# EAGLE schematic my board2 (EAGLE 6.2)
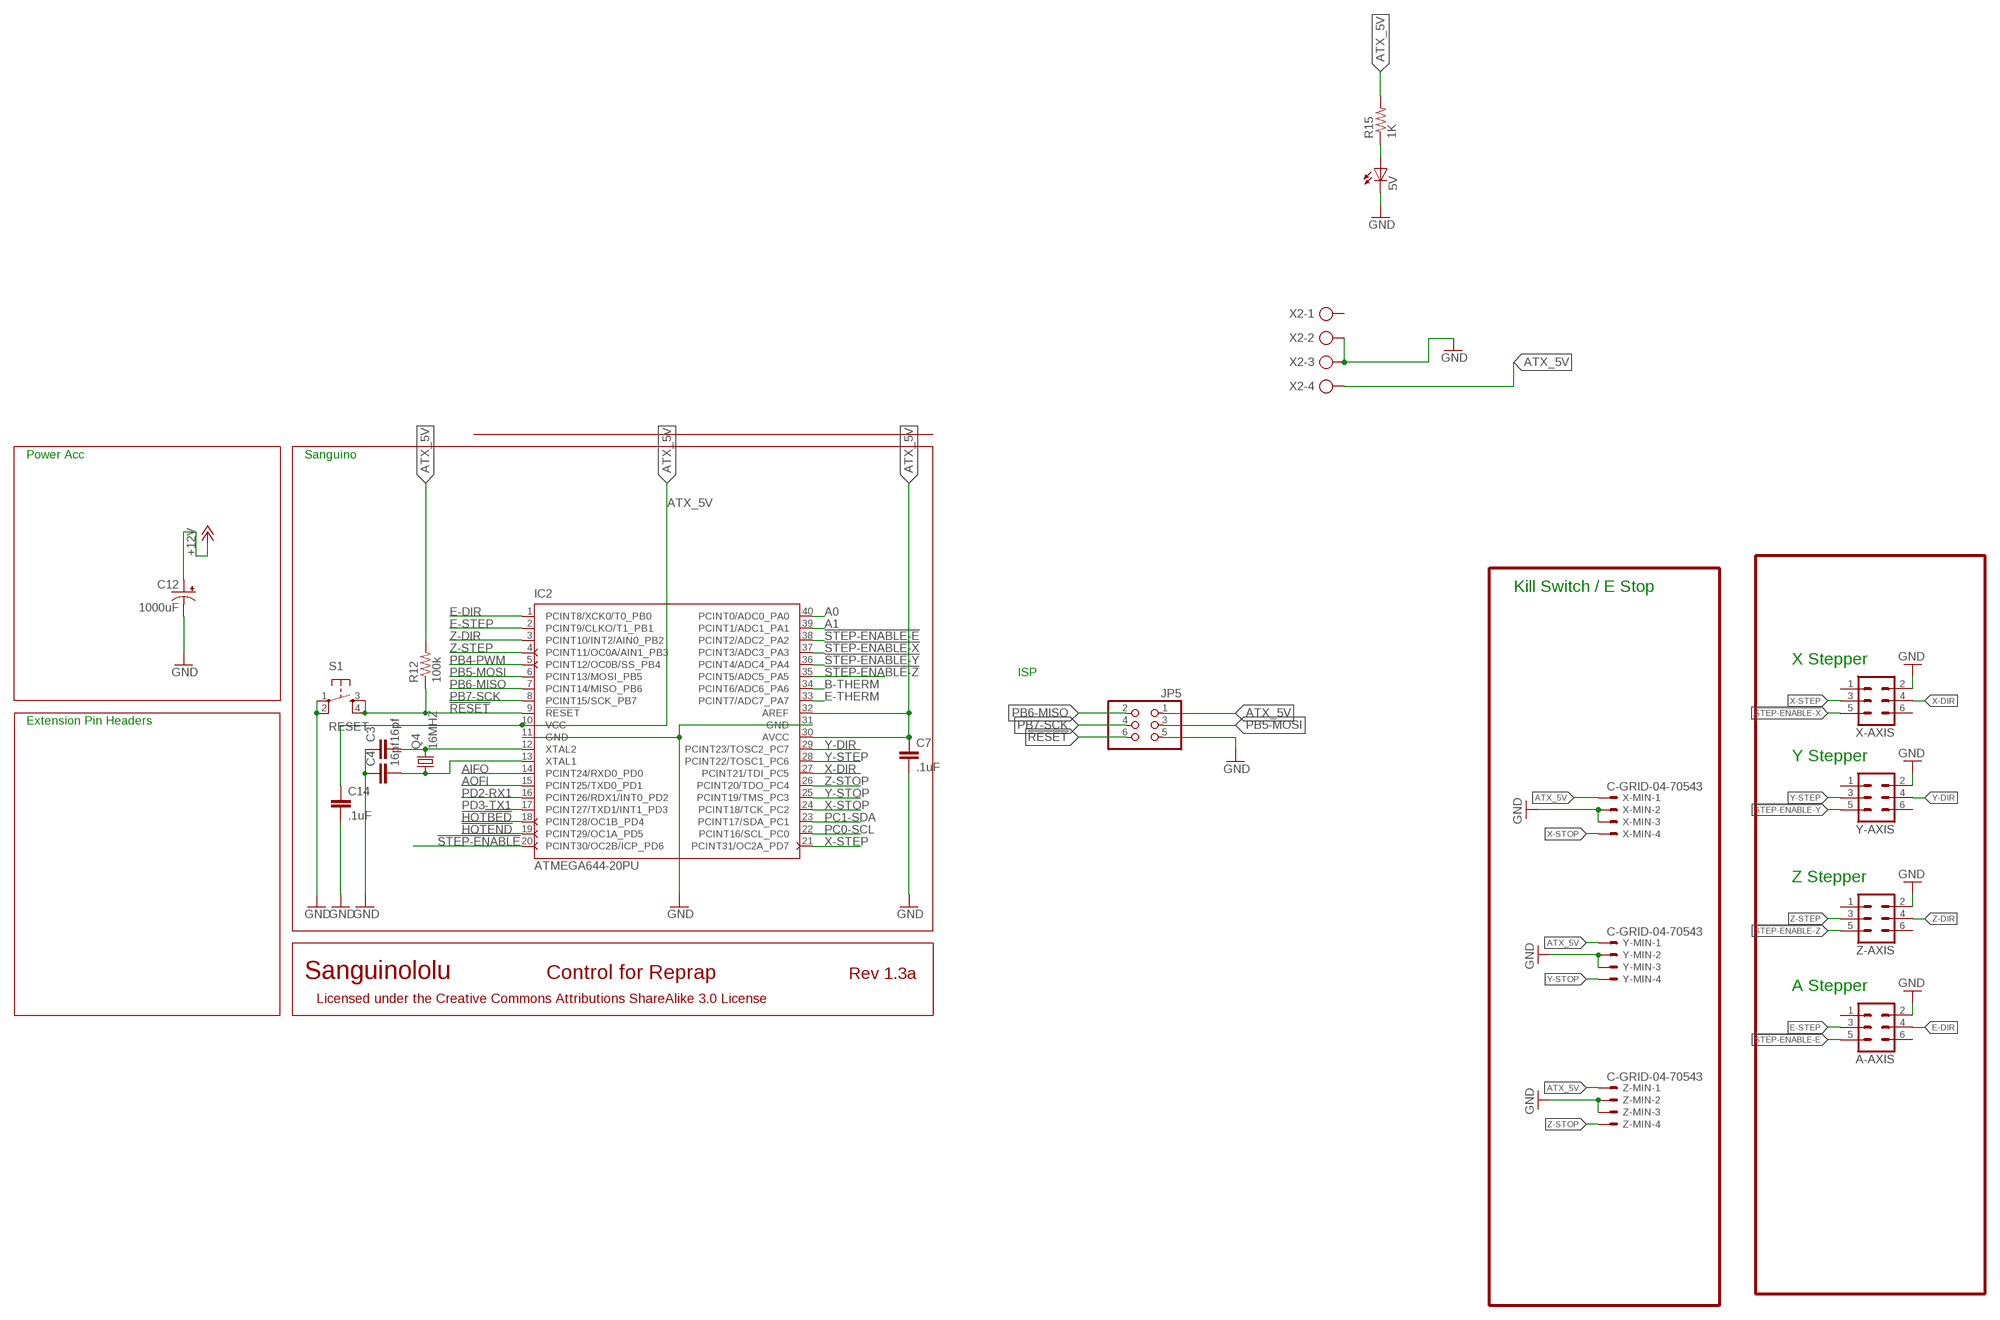
[diagram p0: schematic, sheet 1]

## Parts
5V  LED0805  [LED-0805]
A-AXIS  ML6  [ML6]
C3  16pf  CAP0805  [0805]
C4  16pf  CAP0805  [0805]
C7  .1uF  CAP0805  [0805]
C12  1000uF  CAP_POLPTH4  [CPOL-RADIAL-1000UF-25V]
C14  .1uF  CAP0805  [0805]
IC2  ATMEGA644-20PU  [DIL40]
JP5  PINHD-2X3  [2X03]
Q4  16MHZ  CRYSTALHC49S  [HC49/S]
R12  100k  RESISTORPTH1  [AXIAL-0.3]
R15  1K  RESISTOR  [0805]
S1  RESET  TAC_SWITCHPTH  [TACTILE-PTH]
X2  AK300/4  [AK300/4]
X-AXIS  ML6  [ML6]
X-MIN  C-GRID-04-70543  [70543-04]
Y-AXIS  ML6  [ML6]
Y-MIN  C-GRID-04-70543  [70543-04]
Z-AXIS  ML6  [ML6]
Z-MIN  C-GRID-04-70543  [70543-04]

## Nets
!HOTBED: IC2.18(PCINT28/OC1B_PD4)
!HOTEND: IC2.19(PCINT29/OC1A_PD5)
!RESET: IC2.9(!RESET) JP5.6 R12.P$1 S1.3 S1.4
!STEP-ENABLE: IC2.20(PCINT30/OC2B/ICP_PD6)
!STEP-ENABLE-E: A-AXIS.5 IC2.38(PCINT2/ADC2_PA2)
!STEP-ENABLE-X: IC2.37(PCINT3/ADC3_PA3) X-AXIS.5
!STEP-ENABLE-Y: IC2.36(PCINT4/ADC4_PA4) Y-AXIS.5
!STEP-ENABLE-Z: IC2.35(PCINT5/ADC5_PA5) Z-AXIS.5
+12V [usbvcc]: C12.1(+)
A0: IC2.40(PCINT0/ADC0_PA0)
A1: IC2.39(PCINT1/ADC1_PA1)
AIFO: IC2.14(PCINT24/RXD0_PD0)
AOFI: IC2.15(PCINT25/TXD0_PD1)
ATX_5V [usbvcc]: C7.1 C14.1 IC2.10(VCC) IC2.30(AVCC) IC2.32(AREF) JP5.1 R12.P$2 R15.2 X2.4 X-MIN.1 Y-MIN.1 Z-MIN.1
B-THERM: IC2.34(PCINT6/ADC6_PA6)
E-DIR: A-AXIS.4 IC2.1(PCINT8/XCK0/T0_PB0)
E-STEP: A-AXIS.3 IC2.2(PCINT9/CLKO/T1_PB1)
E-THERM: IC2.33(PCINT7/ADC7_PA7)
GND [power]: 5V.C A-AXIS.2 C3.1 C4.1 C7.2 C12.2(-) C14.2 IC2.11(GND) IC2.31(GND) JP5.5 S1.1 S1.2 X2.2 X2.3 X-AXIS.2 X-MIN.2 X-MIN.3 Y-AXIS.2 Y-MIN.2 Y-MIN.3 Z-AXIS.2 Z-MIN.2 Z-MIN.3
N$25: 5V.A R15.1
N$31: C3.2 IC2.12(XTAL2) Q4.2
N$32: C4.2 IC2.13(XTAL1) Q4.1
PB4-PWM: IC2.5(PCINT12/OC0B/SS_PB4)
PB5-MOSI: IC2.6(PCINT13/MOSI_PB5) JP5.3
PB6-MISO: IC2.7(PCINT14/MISO_PB6) JP5.2
PB7-SCK: IC2.8(PCINT15/SCK_PB7) JP5.4
PC0-SCL: IC2.22(PCINT16/SCL_PC0)
PC1-SDA: IC2.23(PCINT17/SDA_PC1)
PD2-RX1: IC2.16(PCINT26/RDX1/INT0_PD2)
PD3-TX1: IC2.17(PCINT27/TXD1/INT1_PD3)
X-DIR: IC2.27(PCINT21/TDI_PC5) X-AXIS.4
X-STEP: IC2.21(PCINT31/OC2A_PD7) X-AXIS.3
X-STOP: IC2.24(PCINT18/TCK_PC2) X-MIN.4
Y-DIR: IC2.29(PCINT23/TOSC2_PC7) Y-AXIS.4
Y-STEP: IC2.28(PCINT22/TOSC1_PC6) Y-AXIS.3
Y-STOP: IC2.25(PCINT19/TMS_PC3) Y-MIN.4
Z-DIR: IC2.3(PCINT10/INT2/AIN0_PB2) Z-AXIS.4
Z-STEP: IC2.4(PCINT11/OC0A/AIN1_PB3) Z-AXIS.3
Z-STOP: IC2.26(PCINT20/TDO_PC4) Z-MIN.4
Unconnected: A-AXIS.1 A-AXIS.6 X2.1 X-AXIS.1 X-AXIS.6 Y-AXIS.1 Y-AXIS.6 Z-AXIS.1 Z-AXIS.6

## Notes on the sheet
- Power Acc | Sanguino
- Kill Switch / E Stop
- X Stepper
- ISP
- Extension Pin Headers
- Y Stepper
- Z Stepper
- Sanguinololu | Control for Reprap | Rev 1.3a
- A Stepper
- Licensed under the Creative Commons Attributions ShareAlike 3.0 License

## Library data of the parts
5V = SparkFun:LED: LEDs Standard schematic elements and footprints for 5mm, 3mm, 1206, and 0603 sized LEDs. 5mm - Spark Fun Electronics SKU : COM-00529 (and others)
A-AXIS X-AXIS Y-AXIS Z-AXIS = con-ml:ML6: HARTING
C3 C4 C7 C14 = SparkFun:CAP: Capacitor Standard 0603 ceramic capacitor, and 0.1" leaded capacitor.
C12 = SparkFun:CAP_POL: Capacitor Polarized These are standard SMD and PTH capacitors. Normally 10uF, 47uF, and 100uF in electrolytic and tantalum varieties. Always verify the external diameter of the through hole cap, it varies with capacity, voltage, and manufacturer. The EIA devices should be standard.
IC2 = atmel:ATMEGA644-*PU: 8-bit Microcontroller with 64K Bytes In-System Programmable Flash Auto generated by make-symbol-device-package-bsdl.ulp Rev. 34 Source: http://www.atmel.com/dyn/resources/prod_documents/doc2593.pdf; MPN: ATMEGA644-20PU; OC_FARNELL: 1288340; OC_NEWARK: 23M5060
JP5 = pinhead:PINHD-2X3: PIN HEADER
Q4 = crystal:CRYSTAL: CRYSTAL
R12 R15 = SparkFun:RESISTOR: Resistor Basic schematic elements and footprints for 0603, 1206, and PTH 1/10th watt (small) resistors.
S1 = SparkFun:TAC_SWITCH: Momentary Switch Button commonly used for reset or general input. Spark Fun Electronics SKU : COM-00097
X2 = con-ptr500:AK300/4: CONNECTOR; OC_FARNELL: unknown; OC_NEWARK: unknown
X-MIN Y-MIN Z-MIN = con-molex:C-GRID-04: CONNECTOR wire to board 2.54 mm (0.100") pitch header

## Net classes
0 default: width 0.203 mm
1 power: width 0.254 mm
2 gnd: width 0.305 mm, drill 0.711 mm, clearance 0.203 mm
3 usbvcc: width 0.508 mm, drill 0.711 mm, clearance 0.203 mm